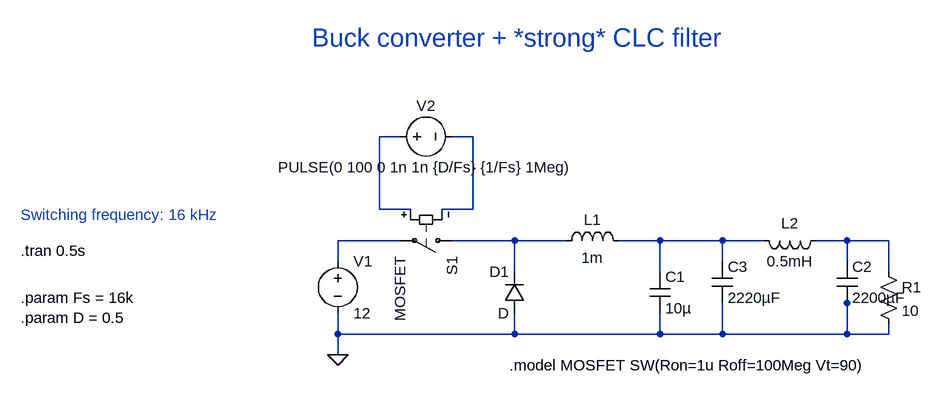
[diagram p0: schematic Buck-converter +  Stronger CLC - 25A+.asc]
Buck-converter +  Stronger CLC - 25A+.asc, the LTspice schematic file:
Version 4
SHEET 1 1244 680
WIRE 96 -64 64 -64
WIRE 208 -64 176 -64
WIRE 64 48 64 -64
WIRE 112 48 64 48
WIRE 208 48 208 -64
WIRE 208 48 160 48
WIRE 96 96 0 96
WIRE 272 96 176 96
WIRE 352 96 272 96
WIRE 496 96 432 96
WIRE 592 96 496 96
WIRE 656 96 592 96
WIRE 784 96 736 96
WIRE 848 96 784 96
WIRE 0 128 0 96
WIRE 592 128 592 96
WIRE 784 128 784 96
WIRE 272 144 272 96
WIRE 496 144 496 96
WIRE 848 144 848 96
WIRE 784 192 784 176
WIRE 0 240 0 208
WIRE 272 240 272 208
WIRE 272 240 0 240
WIRE 496 240 496 208
WIRE 496 240 272 240
WIRE 592 240 592 192
WIRE 592 240 496 240
WIRE 784 240 784 192
WIRE 784 240 592 240
WIRE 848 240 848 224
WIRE 848 240 784 240
WIRE 0 272 0 240
FLAG 0 272 0
SYMBOL voltage 0 112 R0
WINDOW 123 0 0 Left 0
WINDOW 39 0 0 Left 0
SYMATTR InstName V1
SYMATTR Value 12
SYMBOL diode 288 208 R180
WINDOW 0 24 64 Left 2
WINDOW 3 24 0 Left 2
SYMATTR InstName D1
SYMBOL ind 336 112 R270
WINDOW 0 32 56 VTop 2
WINDOW 3 5 56 VBottom 2
SYMATTR InstName L1
SYMATTR Value 1m
SYMBOL cap 480 144 R0
SYMATTR InstName C1
SYMATTR Value 10µ
SYMBOL res 832 128 R0
SYMATTR InstName R1
SYMATTR Value 10
SYMBOL sw 192 96 R90
SYMATTR InstName S1
SYMATTR Value MOSFET
SYMBOL voltage 80 -64 R270
WINDOW 0 32 56 VTop 2
WINDOW 3 -32 56 VBottom 2
WINDOW 123 0 0 Left 0
WINDOW 39 0 0 Left 0
SYMATTR InstName V2
SYMATTR Value PULSE(0 100 0 1n 1n {D/Fs} {1/Fs} 1Meg)
SYMBOL cap 576 128 R0
SYMATTR InstName C3
SYMATTR Value 2220µF
SYMBOL cap 768 128 R0
SYMATTR InstName C2
SYMATTR Value 2200µF
SYMBOL ind 752 80 R90
WINDOW 0 5 56 VBottom 2
WINDOW 3 32 56 VTop 2
SYMATTR InstName L2
SYMATTR Value 0.5mH
TEXT -488 112 Left 2 !.tran 0.5s
TEXT 264 288 Left 2 !.model MOSFET SW(Ron=1u Roff=100Meg Vt=90)
TEXT -488 56 Left 2 ;Switching frequency: 16 kHz
TEXT -488 184 Left 2 !.param Fs = 16k\n.param D = 0.5
TEXT -40 -216 Left 4 ;Buck converter + *strong* CLC filter

The netlist it stands for:
* Buck-converter +  Stronger CLC - 25A+.asc
V1 N003 0 12
D1 0 N004 D
L1 N004 N005 1m
C1 N005 0 10µ
R1 N006 0 10
S1 N004 N003 N001 N002 MOSFET
V2 N001 N002 PULSE(0 100 0 1n 1n {D/Fs} {1/Fs} 1Meg)
C3 N005 0 2220µF
C2 N006 0 2200µF
L2 N006 N005 0.5mH
.model D D
.lib standard.dio
.tran 0.5s
.model MOSFET SW(Ron=1u Roff=100Meg Vt=90)
* Switching frequency: 16 kHz
.param Fs = 16k
.param D = 0.5
* Buck converter + *strong* CLC filter
.backanno
.end